# EAGLE design RPiHeatingArduinoOilSensorTCP (EAGLE 7.5.0)
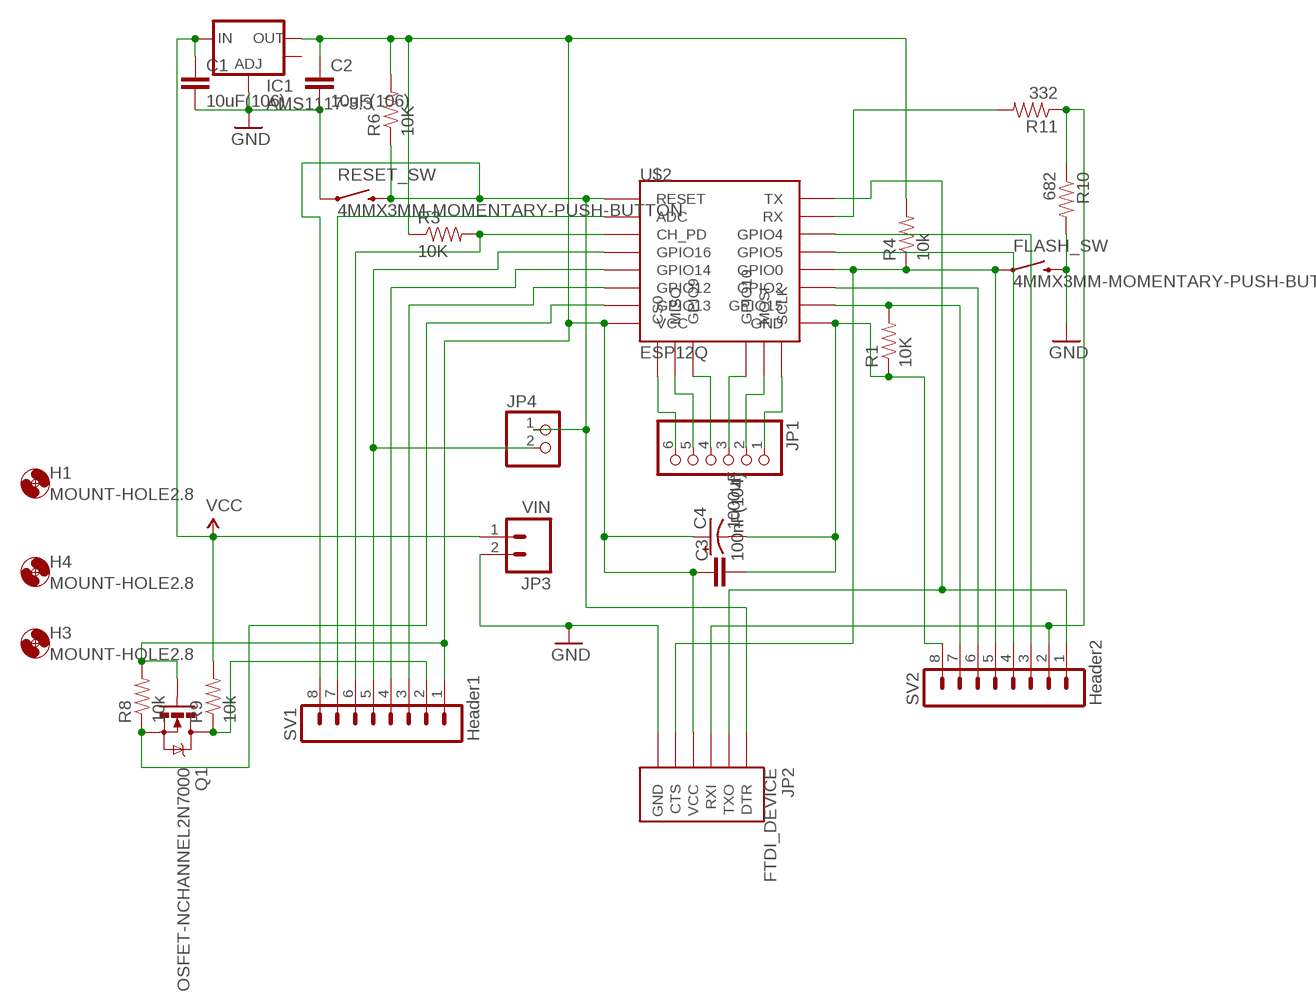
[diagram p0: schematic, sheet 1]

## Parts
C1  10uF(106)  CAP0805  [0805]
C2  10uF(106)  CAP0805  [0805]
C3  100nF(104)  CAP0805  [0805]
C4  1000uF  CAP_POLPTH4  [CPOL-RADIAL-1000UF-25V]
FLASH_SW  4MMX3MM-MOMENTARY-PUSH-BUTTON  [4MMX3MM-MOMENTARY-PUSH-BUTTON]
H1  MOUNT-HOLE2.8  [2,8]
H3  MOUNT-HOLE2.8  [2,8]
H4  MOUNT-HOLE2.8  [2,8]
IC1  AMS1117-3.3  V_REG_LM1117SOT223  [SOT223]
JP1  PINHD-1X6  [1X06]
JP2  FTDI_DEVICE  [FTDI_DEVICE_SIDE]
JP3  VIN  M02LOCK_LONGPADS  [1X02_LOCK_LONGPADS]
JP4  PINHD-1X2  [1X02]
Q1  MOSFET-NCHANNEL2N7000  [TO-92]
R1  10K  RESISTOR0805-RES  [0805]
R3  10K  RESISTOR0805-RES  [0805]
R4  10k  RESISTOR0805-RES  [0805]
R6  10K  RESISTOR0805-RES  [0805]
R8  10k  RESISTOR0805-RES  [0805]
R9  10k  RESISTOR0805-RES  [0805]
R10  682  RESISTOR0805-RES  [0805]
R11  332  RESISTOR0805-RES  [0805]
RESET_SW  4MMX3MM-MOMENTARY-PUSH-BUTTON  [4MMX3MM-MOMENTARY-PUSH-BUTTON]
SV1  Header1  MA08-1  [MA08-1]
SV2  Header2  MA08-1  [MA08-1]
U$2  ESP12Q  [ESP12Q]

## Nets
3.3V: C2.1 C3.1 C4.1(+) IC1.2(OUT) JP2.P$4(VCC) Q1.2(G) R3.1 R4.2 R6.2 R8.2 SV1.1 U$2.VCC
5V: C1.1 IC1.3(IN) JP3.1 R9.2 ; supply symbol labelled VCC
ADC: SV1.7 U$2.ADC
CH_PD: R3.2 SV1.6 U$2.CH_PD
GND: C1.2 C2.2 FLASH_SW.P$2 IC1.1(ADJ) JP2.P$6(GND) JP3.2 R10.2 RESET_SW.P$1
GPIO0: FLASH_SW.P$1 JP2.P$5(CTS) R4.1 SV2.5 U$2.GPIO0
GPIO2: SV2.6 U$2.GPIO2
GPIO4: SV2.3 U$2.GPIO4
GPIO5: SV2.4 U$2.GPIO5
GPIO12: SV1.3 U$2.GPIO12
GPIO13: Q1.1(S) R8.1 U$2.GPIO13
GPIO14: SV1.4 U$2.GPIO14
GPIO15: R1.2 SV2.7 U$2.GPIO15
GPIO16: JP4.2 SV1.5 U$2.GPIO16
GPIOOUT: Q1.3(D) R9.1 SV1.2
N$1: C3.2 C4.2(-) R1.1 SV2.8 U$2.GND
N$2: JP1.1 U$2.SCLK
N$3: JP1.2 U$2.MOSI
N$4: JP1.3 U$2.GPIO10
N$5: JP1.4 U$2.GPIO9
N$6: JP1.5 U$2.MISO
N$7: JP1.6 U$2.CS0
RST: JP2.P$1(DTR) JP4.1 R6.1 RESET_SW.P$2 SV1.8 U$2.RESET
RX3.3: R11.2 U$2.RX
RX5: JP2.P$3(RXI) R10.1 R11.1 SV2.2
TX3.3: JP2.P$2(TXO) SV2.1 U$2.TX
Unconnected: IC1.4(OUT)

## Library data of the parts
C1-C3 = SparkFun-Passives:CAP: Capacitor Standard 0603 ceramic capacitor, and 0.1" leaded capacitor.
C4 = SparkFun-Passives:CAP_POL: Capacitor Polarized These are standard SMD and PTH capacitors. Normally 10uF, 47uF, and 100uF in electrolytic and tantalum varieties. Always verify the external diameter of the through hole cap, it varies with capacity, voltage, and manufacturer. The EIA devices should be standard.
FLASH_SW RESET_SW = 4mmx3mmButton:4MMX3MM-MOMENTARY-PUSH-BUTTON: 4mm x 3mm Momentary Push Button Switch
H1 H3 H4 = holes:MOUNT-HOLE: MOUNTING HOLE with drill center marker
IC1 = SparkFun-PowerIC:V_REG_LM1117: Voltage Regulator LM1117 Standard adjustable voltage regulator but in SMD form. Spark Fun Electronics SKU : COM-00595; PROD_ID: VREG-08170
JP1 = pinhead:PINHD-1X6: PIN HEADER
JP2 = SparkFun-Connectors:FTDI_DEVICE: Connector which mates to FTDI basic or FTDI cable.
JP3 = DECADE-libraries:M02: Header 2 Standard 2-pin 0.1" header. Use with straight break away headers (SKU : PRT-00116), right angle break away headers (PRT-00553), swiss pins (PRT-00743), machine pins (PRT-00117), and female headers (PRT-00115). Molex polarized connector foot print use with SKU : PRT-08233 with associated crimp pins and housings.
JP4 = pinhead:PINHD-1X2: PIN HEADER
Q1 = SparkFun-DiscreteSemi:MOSFET-NCHANNEL: Common NMOSFET Parts MFG P/N Store ID Prod ID FDD8780 TRANS-09984 SI7820DN TRANS-11055 FDS6630A IC-08089 2N7002PW TRANS-11151 FQP30N06L COM-10213 TRANS-10060 BSS123LT1G TRANS-08345 BSS138 TRANS-00830 BS170 2N7000
R1 R3 R4 R6 R8-R11 = SparkFun-Resistors:RESISTOR: Resistor Basic schematic elements and footprints for 0603, 1206, and PTH resistors.
SV1 SV2 = con-lstb:MA08-1: PIN HEADER; OC_FARNELL: unknown; OC_NEWARK: unknown
U$2 = esp826612q:ESP12Q: ESP8266 Wifi module 12-Q

## Board
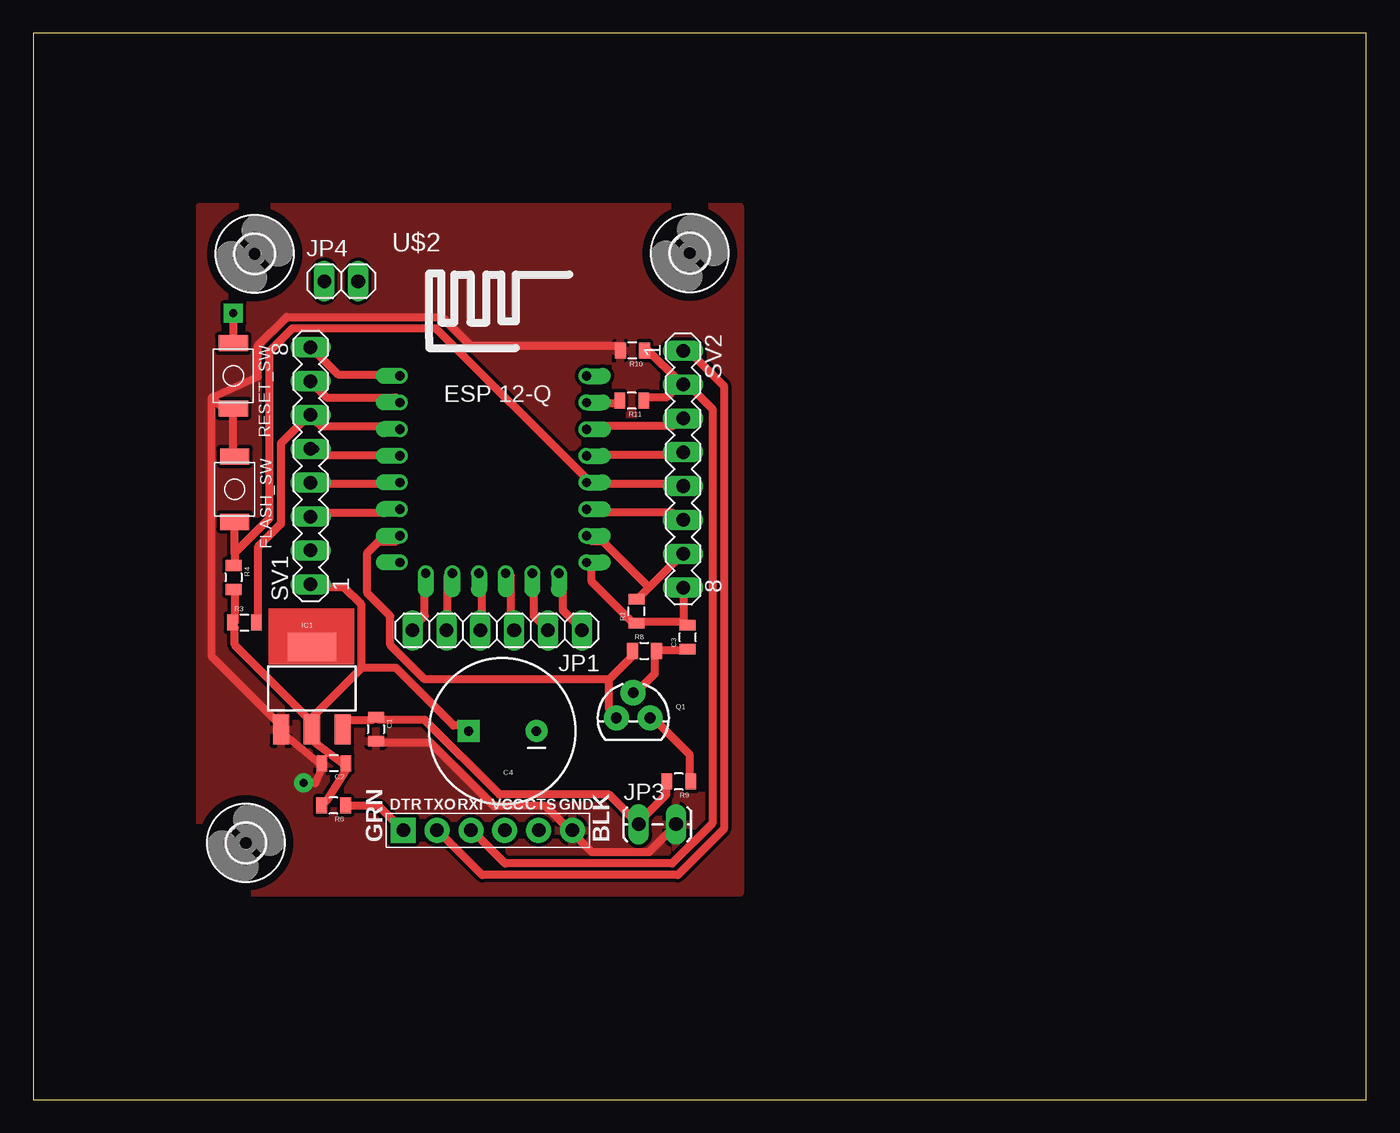
[diagram p1: board, top side]
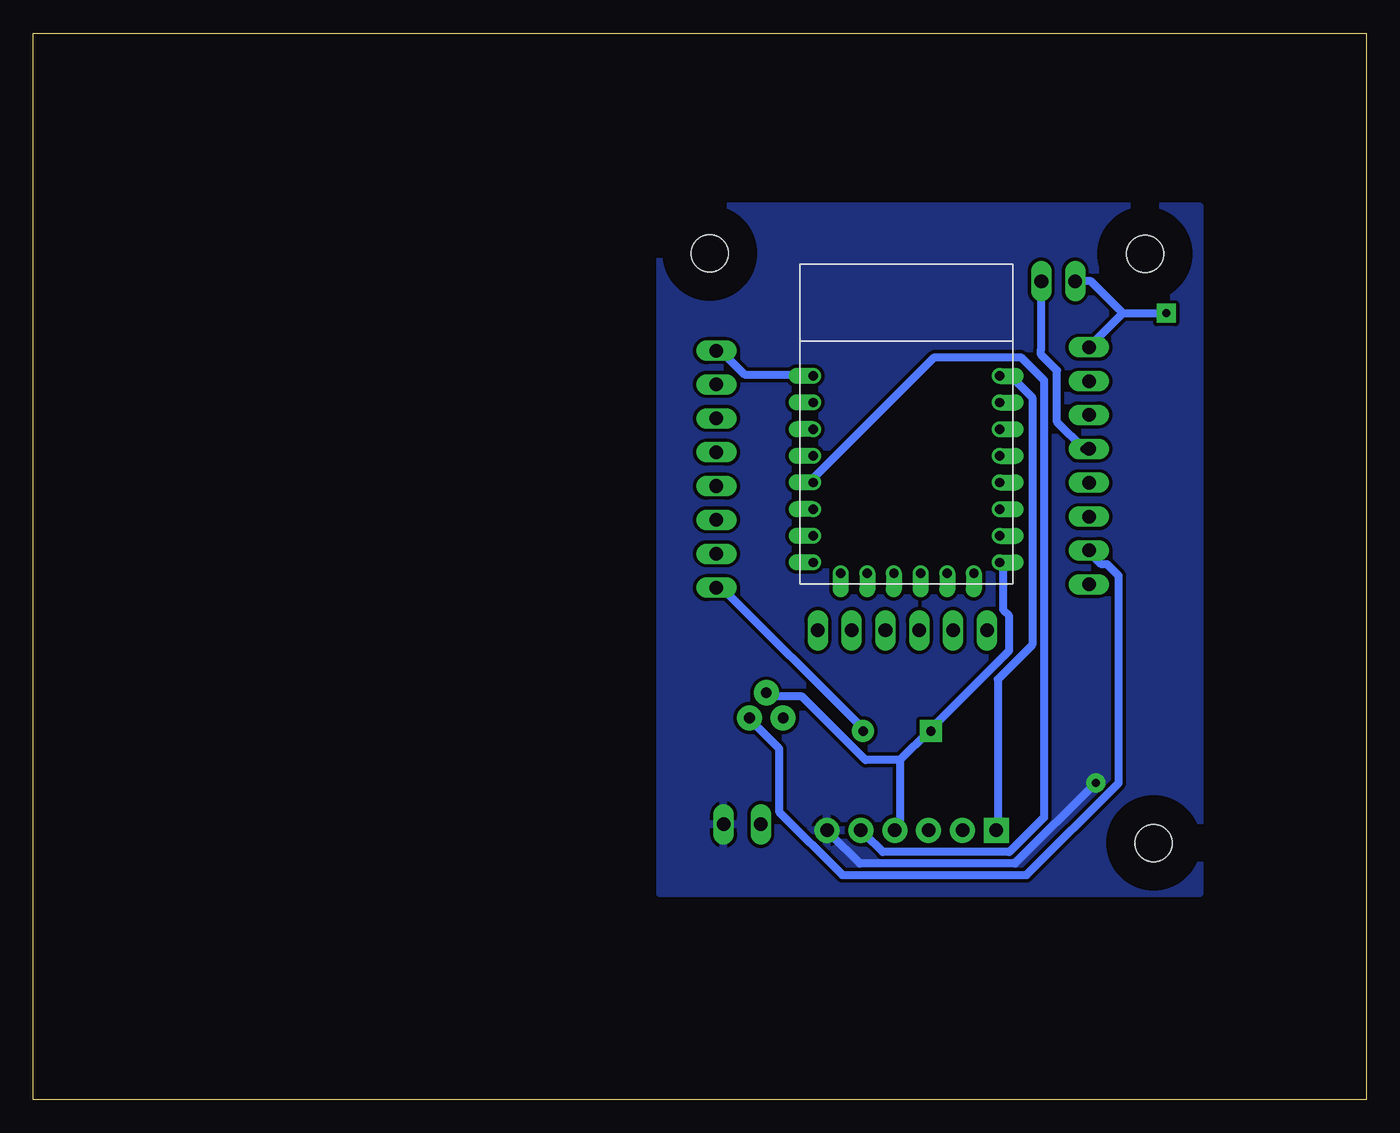
[diagram p2: board, bottom side, seen from below]

Size 100 x 80 mm. Coordinates in mm from the lower left corner, seen from the top.
Outline: 0,0 100,0 100,80 0,80 0,0
Copper layers (1*16): Top 0.035mm / dielectric 1.5mm / Bottom 0.035mm
Design rules "default *": minimum track width 24mil, minimum drill 24mil, track to track 10mil, track to pad 8mil, pad to pad 8mil, via to via 8mil, smd to smd 10mil, copper to edge 40mil, drill to drill 8mil, minimum pad ring 10mil, minimum via ring 16mil, stop-mask expansion 4mil, vias tented up to drill 0mil, thermal gap 10mil

### Footprints (pad centres in the part's own frame; a part is rotated, then mirrored left to right if it is on the bottom)
0805 = smd 0.8 x 1.2: 1 -0.9,0; 2 0.9,0
CPOL-RADIAL-1000UF-25V = drill 0.7 pad 1.651 square: 1 2.54,0 | drill 0.7 pad 1.651: 2 -2.54,0
4MMX3MM-MOMENTARY-PUSH-BUTTON = smd 1.1 x 2.2: P$1 4.5,-1.5; P$2 -0.5,-1.5; P$3 -0.4,-1.5; P$4 4.4,-1.5
2,8 = hole 2.8: 0,0
SOT223 = smd 1.219 x 2.235: 1 -2.311,-3.099; 2 0,-3.099; 3 2.311,-3.099 | smd 3.6 x 2.2: 4 0,3.099
1X06 = drill 1.016 long: 1 -6.35,0; 2 -3.81,0; 3 -1.27,0; 4 1.27,0; 5 3.81,0; 6 6.35,0
FTDI_DEVICE_SIDE = drill 1.016 pad 1.88 square: P$1 -6.35,0 | drill 1.016 pad 1.88: P$2 -3.81,0; P$3 -1.27,0; P$4 1.27,0; P$5 3.81,0; P$6 6.35,0
1X02_LOCK_LONGPADS = drill 1.016 long: 1 -0.127,0; 2 2.667,0
1X02 = drill 1.016 long: 1 -1.27,0; 2 1.27,0
TO-92 = drill 0.813 pad 1.88: 1 -1.27,0; 2 0,1.905; 3 1.27,0
MA08-1 = drill 1.016 long: 1 -8.89,0; 2 -6.35,0; 3 -3.81,0; 4 -1.27,0; 5 1.27,0; 6 3.81,0; 7 6.35,0; 8 8.89,0
ESP12Q = drill 0.7 offset: ADC -7.1,3.8; CH_PD -7.1,1.8; CS0 -5.165,-9.005; GND 6.9,-8.2; GPIO0 6.9,-2.2; GPIO2 6.9,-4.2; GPIO4 6.9,1.8; GPIO5 6.9,-0.2; GPIO9 -1.165,-9.005; GPIO10 0.835,-9.005; GPIO12 -7.1,-4.2; GPIO13 -7.1,-6.2; GPIO14 -7.1,-2.2; GPIO15 6.9,-6.2; GPIO16 -7.1,-0.2; MISO -3.165,-9.005; MOSI 2.835,-9.005; RESET -7.1,5.8; RX 6.9,3.8; SCLK 4.835,-9.005; TX 6.9,5.8; VCC -7.1,-8.2

### Placement (x,y rotation side)
C1  25.7,27.8 270 top
C2  22.55,25.23 180 top
C3  49.09,34.7 90 top
C4  35.2,27.65 180 top
FLASH_SW  16.6,47.8 270 top
H1  15.95,19.25 0 top
H3  16.6,63.45 0 top
H4  49.25,63.5 0 top
IC1  20.9,30.86 0 top
JP1  34.8,35.2 180 top
JP2  34.1,20.2 0 top
JP3  45.55,20.65 0 top
JP4  23.1,61.4 0 top
Q1  45.01,28.62 0 top
R1  45.25,36.65 90 top
R3  15.83,35.78 0 top
R4  15.02,39.17 270 top
R6  22.53,22.06 180 top
R8  45.85,33.67 0 top
R9  48.42,23.86 180 top
R10  44.95,56.21 180 top
R11  44.89,52.44 180 top
RESET_SW  16.5,56.3 270 top
SV1  20.8,47.55 90 top
SV2  48.75,47.3 270 top
U$2  34.6,48.5 0 top

### Tracks (layer width: path | path; a pad name or v marks a point on that pad's centre or on a via)
3.3V
  Top 0.61: R6.2 22.02,22.45 23.45,24.68 C2.1 23.42,25.01 21.16,26.77 21.16,27.64 IC1.2 | R4.2 15.11,38 15.11,35.84 R3.1 15.11,35.41 15.11,34.11 20.73,28.5 | 20.73,28.5 21.16,28.07 IC1.2 | 24.61,32.38 24.61,37.13 23.32,38.43 21.16,38.43 SV1.1 | 20.73,28.5 24.61,32.38 | 20.73,28.5 IC1.2 | C3.1 48.79,33.68 47.07,33.68 R8.2 46.63,33.25 46.63,31.95 45.34,30.66 Q1.2 | 24.61,32.38 27.2,32.38 31.52,28.07 32.38,28.07 C4.1
  Bottom 0.61: U$2.VCC 27.2,40.16 27.2,36.7 26.77,36.27 26.77,33.68 32.38,28.07 C4.1 32.82,27.64 34.98,25.48 | 34.98,25.48 34.98,20.3 JP2.P$4 | 34.98,25.48 37.57,25.48 42.32,30.23 44.91,30.23 Q1.2
5V
  Top 0.61: IC1.3 23.32,28.07 23.75,28.5 25.48,28.5 C1.1 25.91,28.5 29.36,28.5 34.98,22.89 43.18,22.89 45.34,20.73 | 45.34,20.73 47.5,22.89 47.5,23.75 R9.2 | 45.34,20.73 JP3.1
ADC
  Top 0.61: U$2.ADC 27.2,52.68 22.02,52.68 21.16,53.54 SV1.7
CH_PD
  Top 0.61: R3.2 16.84,35.84 16.84,41.45 18.57,43.18 18.57,49.23 20.73,51.38 SV1.6 21.16,50.95 21.59,50.52 27.2,50.52 U$2.CH_PD
GND  (via drill 0.61)
  Top 0.61: C1.2 25.91,26.77 29.79,26.77 34.54,22.02 38.43,22.02 40.16,20.3 JP2.P$6 40.59,19.86 41.88,18.57 46.2,18.57 47.93,20.3 JP3.2 | 13.39,52.68 16.84,54.23 16.84,56.57 19,58.73 30.66,58.73 32.82,56.57 44.04,56.57 R10.2 | 13.39,52.68 13.39,33.25 18.57,28.07 IC1.1 18.57,27.64 21.59,25.11 C2.2 21.59,24.78 21.16,23.75 v20.3,23.75 | FLASH_SW.P$2 15,48.4 RESET_SW.P$1 14.27,51.8 13.39,52.68
  Bottom 0.61: v20.3,23.75 26.34,17.7 38,17.7 40.16,19.86 JP2.P$6
  pour Top: 53,15.5 12.5,15.5 12.5,67 53,67
  pour Bottom: 53,15.5 12.5,15.5 12.5,67 53,67
GPIO0
  Top 0.61: 15.11,41.02 15.11,40.16 R4.1 | 15.11,41.02 17.7,43.61 17.7,56.13 19.43,57.86 30.23,57.86 41.45,46.63 U$2.GPIO0 41.88,46.2 48.36,46.2 SV2.5 | 15.11,41.02 15.1,41.03 FLASH_SW.P$1
  Bottom 0.61: JP2.P$5 37.57,19.86 36.27,18.57 26.77,18.57 24.18,21.16 24.18,53.98 25.91,55.7 32.38,55.7 41.45,46.63 U$2.GPIO0
GPIO2
  Top 0.61: U$2.GPIO2 41.88,44.04 47.93,44.04 48.36,43.61 SV2.6
GPIO4
  Top 0.61: U$2.GPIO4 41.88,50.52 47.93,50.52 48.36,50.95 SV2.3
GPIO5
  Top 0.61: U$2.GPIO5 41.88,48.36 48.36,48.36 SV2.4
GPIO12
  Top 0.61: U$2.GPIO12 27.2,44.04 21.16,44.04 SV1.3
GPIO13
  Top 0.61: 43.18,31.52 44.91,33.25 R8.1 | 43.18,31.52 43.18,29.36 43.61,28.93 Q1.1 | 43.18,31.52 29.36,31.52 26.77,34.11 26.77,36.27 25.04,38 25.04,41.02 25.91,41.88 27.2,41.88 U$2.GPIO13
GPIO14
  Top 0.61: U$2.GPIO14 27.2,46.2 21.16,46.2 SV1.4
GPIO15
  Top 0.61: 46.2,38.43 48.36,40.59 SV2.7 | 46.2,38.43 45.34,37.57 R1.2 | 46.2,38.43 42.75,41.88 41.88,41.88 U$2.GPIO15
GPIO16  (via drill 0.6)
  Top 0.61: U$2.GPIO16 27.2,48.36 21.59,48.36 v21.16,48.79 SV1.5
  Bottom 0.61: v21.16,48.79 23.2,50.84 23.2,54.7 24.4,55.9 24.4,56.3 24.37,56.33 JP4.2
GPIOOUT
  Top 0.61: R9.1 49.23,24.18 49.23,25.91 46.63,28.5 Q1.3
  Bottom 0.61: SV1.2 20.73,41.02 19.86,40.16 19.43,40.16 18.57,39.29 18.57,23.75 25.48,16.84 39.29,16.84 44.04,21.59 44.04,26.34 46.2,28.5 Q1.3
N$1
  Top 0.61: 48.79,35.84 48.79,38 SV2.8 | 48.79,35.84 45.34,35.84 R1.1 44.91,35.84 41.88,38.86 41.88,40.16 U$2.GND | 48.79,35.84 C3.2
  Bottom 0.61: C4.2 38,28.07 48.36,38.43 SV2.8
N$2
  Top 0.61: U$2.SCLK 39.73,39.29 39.73,36.7 41.02,35.41 JP1.1
N$3
  Top 0.61: U$2.MOSI 37.57,39.29 37.57,36.27 38.43,35.41 JP1.2
N$4
  Top 0.61: U$2.GPIO10 35.84,39.29 35.84,35.41 JP1.3
N$5
  Top 0.61: U$2.GPIO9 33.68,39.29 33.68,35.41 JP1.4
N$6
  Top 0.61: U$2.MISO 31.09,39.29 31.09,35.41 JP1.5
N$7
  Top 0.61: U$2.CS0 29.36,39.29 29.36,36.27 28.5,35.41 JP1.6
RST  (via drill 0.6)
  Top 0.61: R6.1 23.75,22.02 25.91,22.02 27.64,20.3 JP2.P$1 | U$2.RESET 27.2,54.41 22.89,54.41 21.16,56.13 SV1.8 | v15,59 RESET_SW.P$2
  Bottom 0.61: JP2.P$1 27.64,20.3 27.64,31.52 25.04,34.11 25.04,52.68 26.34,53.98 27.2,53.98 U$2.RESET | SV1.8 18.24,59 | 18.24,59 v15,59 | 18.24,59 20.64,61.4 JP4.1
RX3.3
  Top 0.61: R11.2 43.61,52.25 41.88,52.25 U$2.RX
RX5
  Top 0.61: R11.1 45.77,52.68 47.5,52.68 48.36,53.54 SV2.2 | R10.1 46.2,56.13 48.36,53.98 SV2.2 | JP2.P$3 33.25,19.86 35.41,17.7 47.93,17.7 50.95,20.73 50.95,51.82 48.79,53.98 SV2.2
TX3.3
  Top 0.61: JP2.P$2 30.66,19.86 33.68,16.84 48.36,16.84 51.82,20.3 51.82,53.54 48.79,56.57 SV2.1
  Bottom 0.61: U$2.TX 41.88,54.41 46.63,54.41 48.36,56.13 SV2.1
(copper drawn outside any net)
  shapes: Top area x1